# Altium schematic sheet Managment_MCU.SchDoc
size 420 x 297 mm; SheetNumber: 2; SheetTotal: 6; ModifiedBy: -; CheckedDate: -; Title2: Title 2; DivGrp: WUT ISE; Designer: G.Kasprowicz
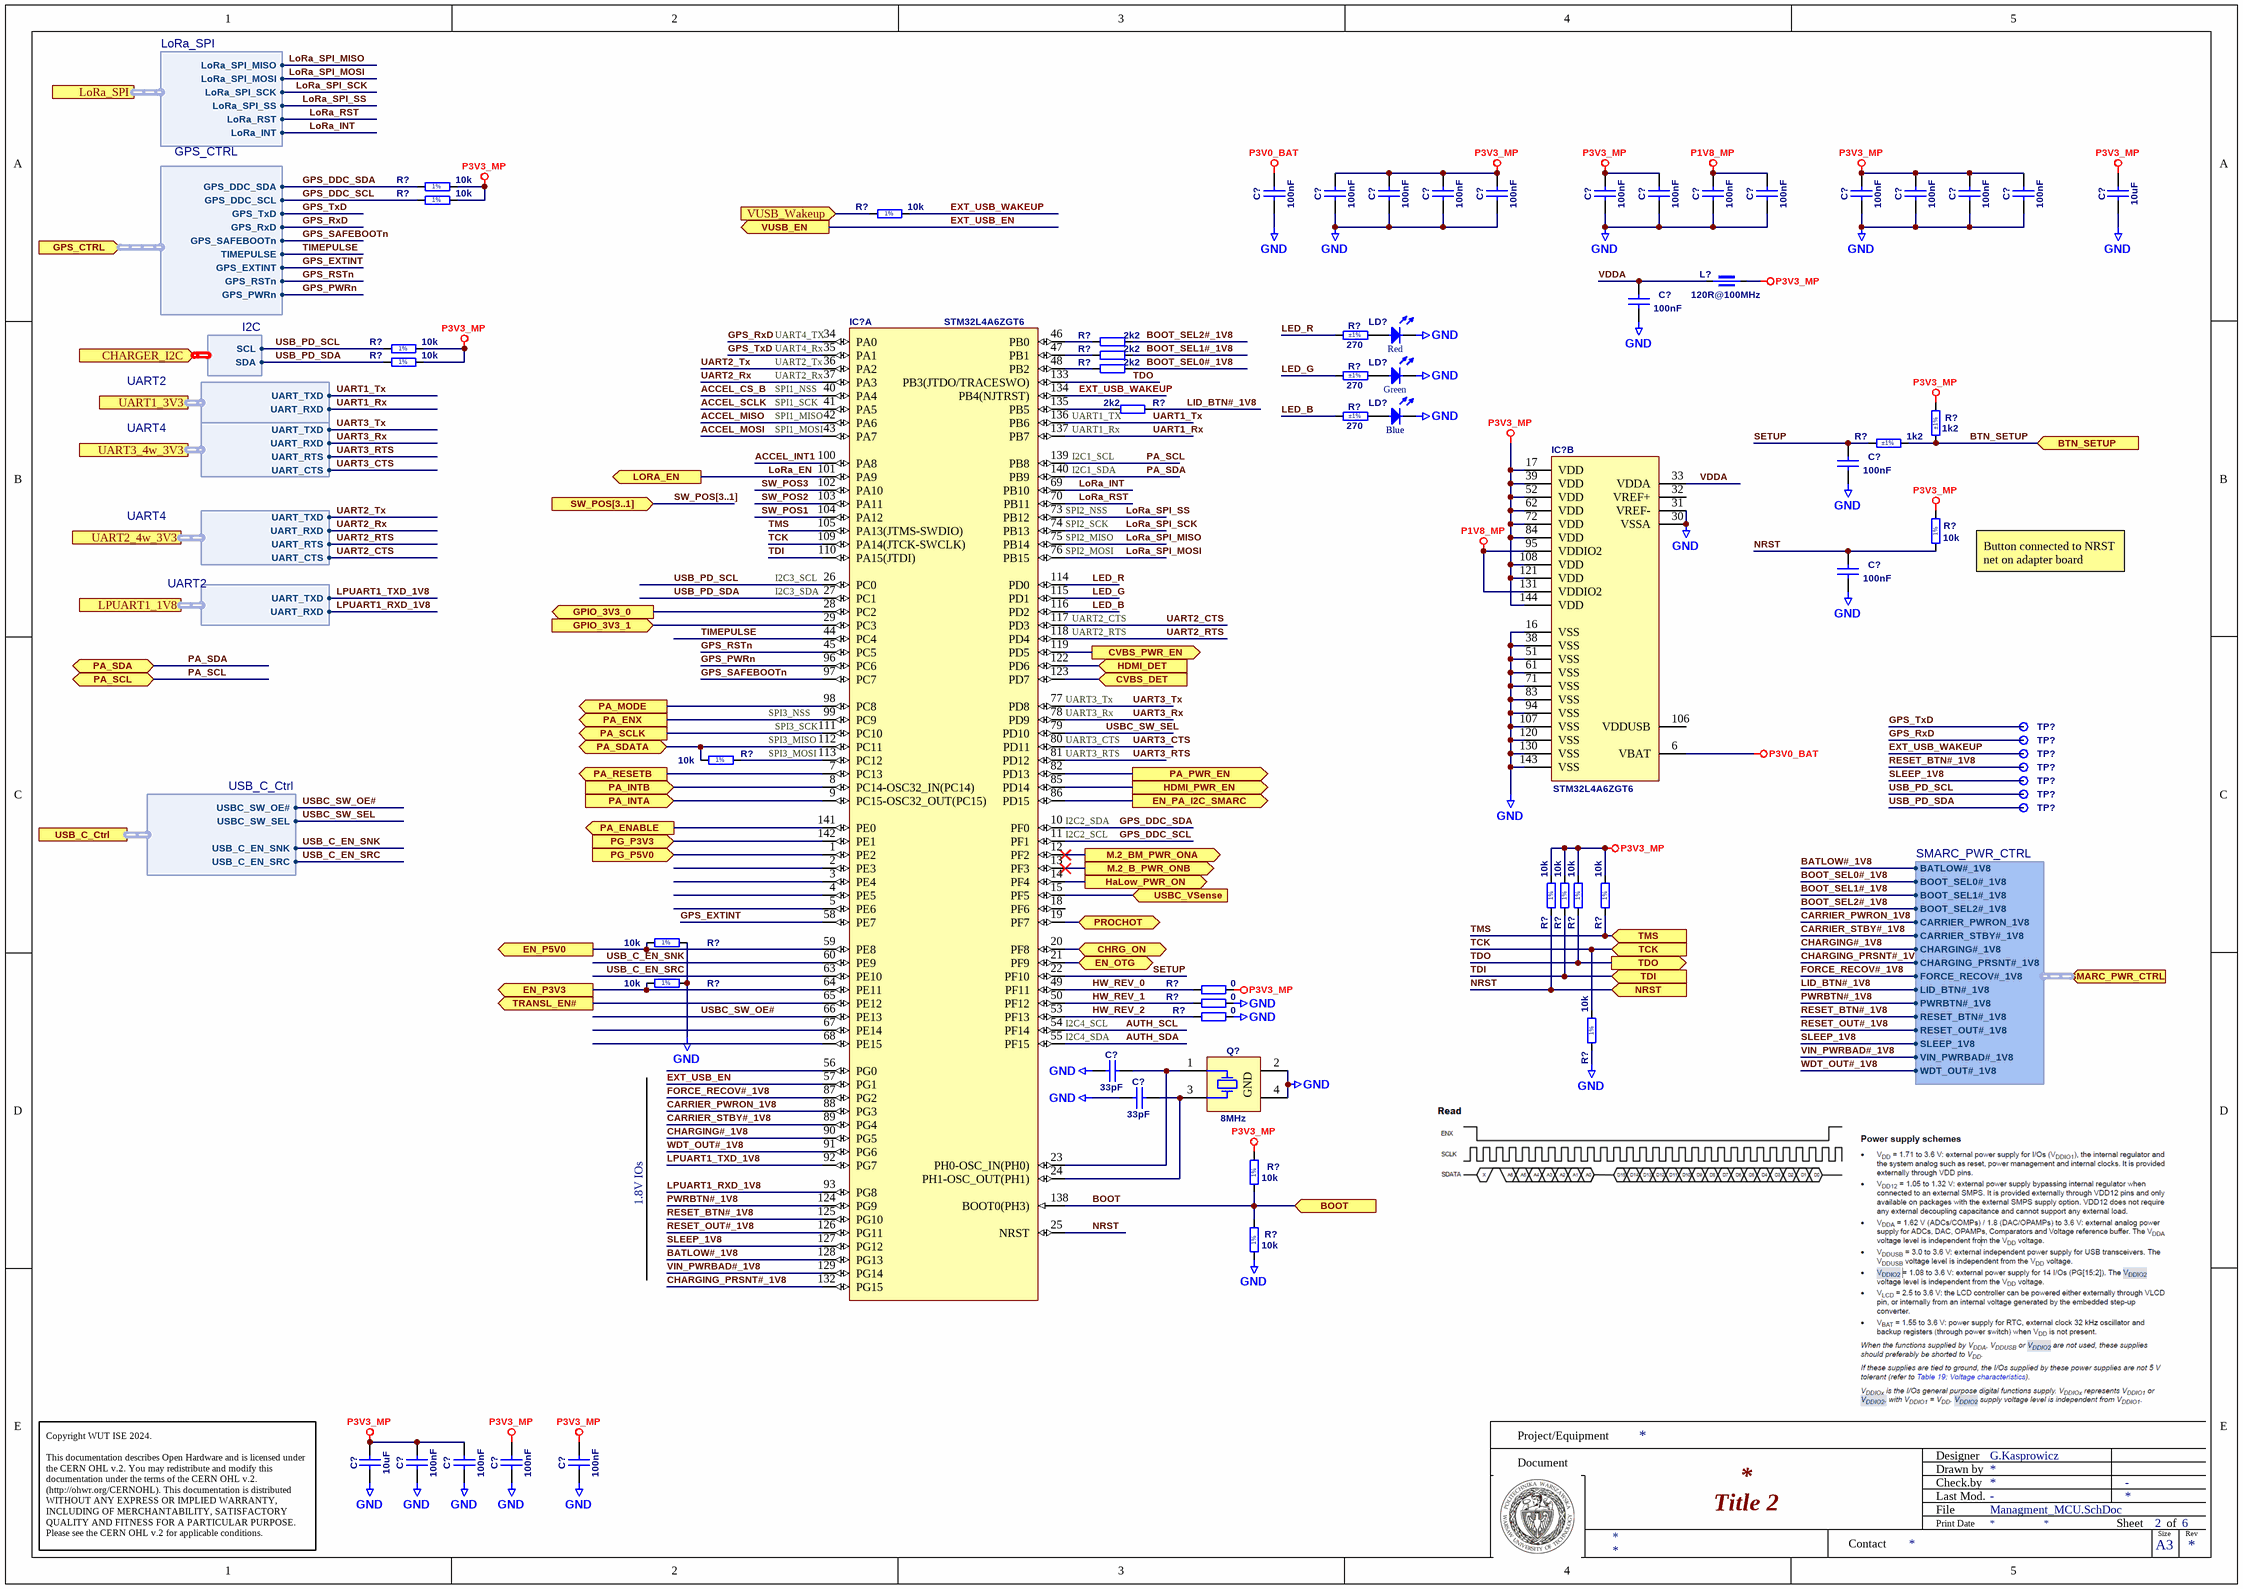
[diagram p0: Managment_MCU.SchDoc]

## Parts
(Parts that share a designator on the sheet are numbered #1, #2 ... from top to bottom, then left to right.)
C?#1  100nF  [CAPC1005X55N]
C?#2  100nF  [CAPC1005X55N]
C?#3  100nF  [CAPC1005X55N]
C?#4  100nF  [CAPC1005X55N]
C?#5  100nF  [CAPC1005X55N]
C?#6  100nF  [CAPC1005X55N]
C?#7  100nF  [CAPC1005X55N]
C?#8  100nF  [CAPC1005X55N]
C?#9  100nF  [CAPC1005X55N]
C?#10  100nF  [CAPC1005X55N]
C?#11  100nF  [CAPC1005X55N]
C?#12  100nF  [CAPC1005X55N]
C?#13  100nF  [CAPC1005X55N]
C?#14  10uF  [CAPC1608X80N]
C?#15  100nF  [CAPC1005X55N]
C?#16  100nF  [CAPC1005X55N]
C?#17  100nF  [CAPC1005X55N]
C?#18  33pF  [CAPC1005X55N]
C?#19  33pF  [CAPC1005X55N]
C?#20  10uF  [CAPC1608X80N]
C?#21  100nF  [CAPC1005X55N]
C?#22  100nF  [CAPC1005X55N]
C?#23  100nF  [CAPC1005X55N]
C?#24  100nF  [CAPC1005X55N]
IC?#1  STM32L4A6ZGT6  [QFP50P2200X2200X160-144N]  (part A of 2)
IC?#2  STM32L4A6ZGT6  [QFP50P2200X2200X160-144N]  (part B of 2)
L?  120R@100MHz  [INDC1608X65N]
LD?#1  Red  [LED_AVAGO_HSMC-C120]
LD?#2  Green  [LED_AVAGO_HSME-C120]
LD?#3  Blue  [LED_AVAGO_HSMR-C120]
Q?  8MHz  [XTAL_ECS_ECX-32]
R?#1  10k  [RESC1005X40N]
R?#2  10k  [RESC1005X40N]
R?#3  10k  [RESC1005X40N]
R?#4  270  Tolerance: ±1%  [RESC1005X40N]
R?#5  2k2  [RESC1005X40N]
R?#6  10k  [RESC1005X40N]
R?#7  2k2  [RESC1005X40N]
R?#8  10k  [RESC1005X40N]
R?#9  2k2  [RESC1005X40N]
R?#10  270  Tolerance: ±1%  [RESC1005X40N]
R?#11  2k2  [RESC1005X40N]
R?#12  270  Tolerance: ±1%  [RESC1005X40N]
R?#13  1k2  Tolerance: ±1%  [RESC1005X40N]
R?#14  1k2  Tolerance: ±1%  [RESC1005X40N]
R?#15  10k  [RESC1005X40N]
R?#16  10k  [RESC1005X40N]
R?#17  10k  [RESC1005X40N]
R?#18  10k  [RESC1005X40N]
R?#19  10k  [RESC1005X40N]
R?#20  10k  [RESC1005X40N]
R?#21  10k  [RESC1005X40N]
R?#22  10k  [RESC1005X40N]
R?#23  0  [RESC1005X40N]
R?#24  0  [RESC1005X40N]
R?#25  0  [RESC1005X40N]
R?#26  10k  [RESC1005X40N]
R?#27  10k  [RESC1005X40N]
R?#28  10k  [RESC1005X40N]
TP?#1  Test Point  [TPS127]  (value not drawn)  (no BOM)
TP?#2  Test Point  [TPS127]  (value not drawn)  (no BOM)
TP?#3  Test Point  [TPS127]  (value not drawn)  (no BOM)
TP?#4  Test Point  [TPS127]  (value not drawn)  (no BOM)
TP?#5  Test Point  [TPS127]  (value not drawn)  (no BOM)
TP?#6  Test Point  [TPS127]  (value not drawn)  (no BOM)
TP?#7  Test Point  [TPS127]  (value not drawn)  (no BOM)

## Ports
BOOT (in), BTN_SETUP (in), CHARGER_I2C (in, harness I2C), CHRG_ON (bidir), CVBS_DET (in), CVBS_PWR_EN (out), EN_OTG (bidir), EN_P3V3 (out), EN_P5V0 (out), EN_PA_I2C_SMARC (out), GPIO_3V3_0 (out), GPIO_3V3_1 (in), GPS_CTRL (in, harness GPS_CTRL), HaLow_PWR_ON (out), HDMI_DET (in), HDMI_PWR_EN (out), LORA_EN (out), LoRa_SPI (harness LoRa_SPI), LPUART1_1V8 (harness UART2), M.2_B_PWR_ONB (out), M.2_BM_PWR_ONA (out), NRST (in), PA_ENABLE (out), PA_ENX (out), PA_INTA (in), PA_INTB (in), PA_MODE (out), PA_PWR_EN (out), PA_RESETB (out), PA_SCL (bidir), PA_SCLK (out), PA_SDA (bidir), PA_SDATA (bidir), PG_P3V3 (in), PG_P5V0 (in), PROCHOT (bidir), SMARC_PWR_CTRL (in, harness SMARC_PWR_CTRL), SW_POS[3..1] (in), TCK (in), TDI (in), TDO (out), TMS (in), TRANSL_EN# (out), UART1_3V3 (harness UART2), UART2_4w_3V3 (harness UART4), UART3_4w_3V3 (harness UART4), USB_C_Ctrl (harness USB_C_Ctrl), USBC_VSense (in), VUSB_EN (out), VUSB_Wakeup (in)

## Harnesses
LoRa_SPI: LoRa_SPI_MISO, LoRa_SPI_MOSI, LoRa_SPI_SCK, LoRa_SPI_SS, LoRa_RST, LoRa_INT
GPS_CTRL: GPS_TxD, GPS_RxD, GPS_SAFEBOOTn, TIMEPULSE, GPS_EXTINT, GPS_RSTn, GPS_DDC_SDA, GPS_DDC_SCL, GPS_PWRn
I2C: SCL, SDA
SMARC_PWR_CTRL: BATLOW#_1V8, BOOT_SEL0#_1V8, BOOT_SEL1#_1V8, BOOT_SEL2#_1V8, CARRIER_PWRON_1V8, CARRIER_STBY#_1V8, CHARGING#_1V8, CHARGING_PRSNT#_1V8, FORCE_RECOV#_1V8, LID_BTN#_1V8, PWRBTN#_1V8, RESET_BTN#_1V8, RESET_OUT#_1V8, SLEEP_1V8, VIN_PWRBAD#_1V8, WDT_OUT#_1V8
UART4: UART_TXD, UART_RXD, UART_RTS, UART_CTS
UART2: UART_TXD, UART_RXD
USB_C_Ctrl: USBC_SW_OE#, USBC_SW_SEL, USB_C_EN_SNK, USB_C_EN_SRC

## Nets
GND: C?#1.1 C?#2.1 C?#3.1 C?#4.1 C?#5.1 C?#6.1 C?#7.1 C?#8.1 C?#9.1 C?#10.1 C?#11.1 C?#12.1 C?#13.1 C?#14.1 C?#15.1 C?#16.1 C?#17.1 C?#18.1 C?#19.1 C?#20.1 C?#21.1 C?#22.1 C?#23.1 C?#24.1 IC?#2.16(VSS) IC?#2.30(VSSA) IC?#2.31(VREF-) IC?#2.38(VSS) IC?#2.51(VSS) IC?#2.61(VSS) IC?#2.71(VSS) IC?#2.83(VSS) IC?#2.94(VSS) IC?#2.107(VSS) IC?#2.120(VSS) IC?#2.130(VSS) IC?#2.143(VSS) LD?#1.1(C) LD?#2.1(C) LD?#3.1(C) Q?.2(GND) Q?.4(GND) R?#21.2 R?#22.2 R?#24.1 R?#25.1 R?#26.1 R?#28.1
P1V8_MP: C?#8.2 C?#9.2 IC?#2.95(VDDIO2) IC?#2.131(VDDIO2)
P3V0_BAT: C?#1.2 IC?#2.6(VBAT)
P3V3_MP: C?#2.2 C?#3.2 C?#4.2 C?#5.2 C?#6.2 C?#7.2 C?#10.2 C?#11.2 C?#12.2 C?#13.2 C?#14.2 C?#20.2 C?#21.2 C?#22.2 C?#23.2 C?#24.2 IC?#2.17(VDD) IC?#2.39(VDD) IC?#2.52(VDD) IC?#2.62(VDD) IC?#2.72(VDD) IC?#2.84(VDD) IC?#2.108(VDD) IC?#2.121(VDD) IC?#2.144(VDD) L?.2 R?#1.2 R?#2.2 R?#6.2 R?#8.2 R?#14.2 R?#15.2 R?#17.2 R?#18.2 R?#19.2 R?#20.2 R?#23.2 R?#27.2
ACCEL_CS_B: IC?#1.40(PA4)
ACCEL_INT1: IC?#1.100(PA8)
ACCEL_MISO: IC?#1.42(PA6)
ACCEL_MOSI: IC?#1.43(PA7)
ACCEL_SCLK: IC?#1.41(PA5)
AUTH_SCL: IC?#1.54(PF14)
AUTH_SDA: IC?#1.55(PF15)
BATLOW#_1V8: IC?#1.128(PG13) ; port SMARC_PWR_CTRL.BATLOW#_1V8
BOOT: IC?#1.138(BOOT0(PH3)) R?#27.1 R?#28.2 ; port BOOT
BOOT_SEL0#_1V8: R?#9.2 ; port SMARC_PWR_CTRL.BOOT_SEL0#_1V8
BOOT_SEL1#_1V8: R?#7.2 ; port SMARC_PWR_CTRL.BOOT_SEL1#_1V8
BOOT_SEL2#_1V8: R?#5.2 ; port SMARC_PWR_CTRL.BOOT_SEL2#_1V8
BTN_SETUP: R?#13.2 R?#14.1 ; port BTN_SETUP
CARRIER_PWRON_1V8: IC?#1.88(PG3) ; port SMARC_PWR_CTRL.CARRIER_PWRON_1V8
CARRIER_STBY#_1V8: IC?#1.89(PG4) ; port SMARC_PWR_CTRL.CARRIER_STBY#_1V8
CHARGING#_1V8: IC?#1.90(PG5) ; port SMARC_PWR_CTRL.CHARGING#_1V8
CHARGING_PRSNT#_1V8: IC?#1.132(PG15) ; port SMARC_PWR_CTRL.CHARGING_PRSNT#_1V8
CHRG_ON: IC?#1.20(PF8) ; port CHRG_ON
CVBS_DET: IC?#1.123(PD7) ; port CVBS_DET
CVBS_PWR_EN: IC?#1.119(PD5) ; port CVBS_PWR_EN
EN_OTG: IC?#1.21(PF9) ; port EN_OTG
EN_P3V3: IC?#1.64(PE11) R?#22.1 ; port EN_P3V3
EN_P5V0: IC?#1.59(PE8) R?#21.1 ; port EN_P5V0
EN_PA_I2C_SMARC: IC?#1.86(PD15) ; port EN_PA_I2C_SMARC
EXT_USB_EN: IC?#1.57(PG1) ; port VUSB_EN
EXT_USB_WAKEUP: IC?#1.134(PB4(NJTRST)) R?#3.2 TP?#3.1
FORCE_RECOV#_1V8: IC?#1.87(PG2) ; port SMARC_PWR_CTRL.FORCE_RECOV#_1V8
GPIO_3V3_0: IC?#1.28(PC2) ; port GPIO_3V3_0
GPIO_3V3_1: IC?#1.29(PC3) ; port GPIO_3V3_1
GPS_DDC_SCL: IC?#1.11(PF1) R?#2.1 ; port GPS_CTRL.GPS_DDC_SCL
GPS_DDC_SDA: IC?#1.10(PF0) R?#1.1 ; port GPS_CTRL.GPS_DDC_SDA
GPS_EXTINT: IC?#1.58(PE7) ; port GPS_CTRL.GPS_EXTINT
GPS_PWRn: IC?#1.96(PC6) ; port GPS_CTRL.GPS_PWRn
GPS_RSTn: IC?#1.45(PC5) ; port GPS_CTRL.GPS_RSTn
GPS_RxD: IC?#1.34(PA0) TP?#2.1 ; port GPS_CTRL.GPS_RxD
GPS_SAFEBOOTn: IC?#1.97(PC7) ; port GPS_CTRL.GPS_SAFEBOOTn
GPS_TxD: IC?#1.35(PA1) TP?#1.1 ; port GPS_CTRL.GPS_TxD
HaLow_PWR_ON: IC?#1.14(PF4) ; port HaLow_PWR_ON
HDMI_DET: IC?#1.122(PD6) ; port HDMI_DET
HDMI_PWR_EN: IC?#1.85(PD14) ; port HDMI_PWR_EN
HW_REV_0: IC?#1.49(PF11) R?#23.1
HW_REV_1: IC?#1.50(PF12) R?#24.2
HW_REV_2: IC?#1.53(PF13) R?#25.2
LED_B: IC?#1.116(PD2) R?#12.2
LED_G: IC?#1.115(PD1) R?#10.2
LED_R: IC?#1.114(PD0) R?#4.2
LID_BTN#_1V8: R?#11.1 ; port SMARC_PWR_CTRL.LID_BTN#_1V8
LoRa_EN: IC?#1.101(PA9) ; port LORA_EN
LoRa_INT: IC?#1.69(PB10) ; port LoRa_SPI.LoRa_INT
LoRa_RST: IC?#1.70(PB11) ; port LoRa_SPI.LoRa_RST
LoRa_SPI_MISO: IC?#1.75(PB14) ; port LoRa_SPI.LoRa_SPI_MISO
LoRa_SPI_MOSI: IC?#1.76(PB15) ; port LoRa_SPI.LoRa_SPI_MOSI
LoRa_SPI_SCK: IC?#1.74(PB13) ; port LoRa_SPI.LoRa_SPI_SCK
LoRa_SPI_SS: IC?#1.73(PB12) ; port LoRa_SPI.LoRa_SPI_SS
LPUART1_RXD_1V8: IC?#1.93(PG8) ; port LPUART1_1V8.UART_RXD
LPUART1_TXD_1V8: IC?#1.92(PG7) ; port LPUART1_1V8.UART_TXD
M.2_B_PWR_ONB: IC?#1.13(PF3) ; port M.2_B_PWR_ONB
M.2_BM_PWR_ONA: IC?#1.12(PF2) ; port M.2_BM_PWR_ONA
NRST: C?#17.2 IC?#1.25(NRST) R?#15.1 R?#17.1 ; port NRST
PA_ENABLE: IC?#1.141(PE0) ; port PA_ENABLE
PA_ENX: IC?#1.99(PC9) ; port PA_ENX
PA_INTA: IC?#1.9(PC15-OSC32_OUT(PC15)) ; port PA_INTA
PA_INTB: IC?#1.8(PC14-OSC32_IN(PC14)) ; port PA_INTB
PA_MODE: IC?#1.98(PC8) ; port PA_MODE
PA_PWR_EN: IC?#1.82(PD13) ; port PA_PWR_EN
PA_RESETB: IC?#1.7(PC13) ; port PA_RESETB
PA_SCL: IC?#1.139(PB8) ; port PA_SCL
PA_SCLK: IC?#1.111(PC10) ; port PA_SCLK
PA_SDA: IC?#1.140(PB9) ; port PA_SDA
PA_SDATA: IC?#1.112(PC11) R?#16.1 ; port PA_SDATA
PG_P3V3: IC?#1.142(PE1) ; port PG_P3V3
PG_P5V0: IC?#1.1(PE2) ; port PG_P5V0
PROCHOT: IC?#1.19(PF7) ; port PROCHOT
PWRBTN#_1V8: IC?#1.124(PG9) ; port SMARC_PWR_CTRL.PWRBTN#_1V8
RESET_BTN#_1V8: IC?#1.125(PG10) TP?#4.1 ; port SMARC_PWR_CTRL.RESET_BTN#_1V8
RESET_OUT#_1V8: IC?#1.126(PG11) ; port SMARC_PWR_CTRL.RESET_OUT#_1V8
SETUP: C?#16.2 IC?#1.22(PF10) R?#13.1
SLEEP_1V8: IC?#1.127(PG12) TP?#5.1 ; port SMARC_PWR_CTRL.SLEEP_1V8
SW_POS1: IC?#1.104(PA12)
SW_POS2: IC?#1.103(PA11)
SW_POS3: IC?#1.102(PA10)
TCK: IC?#1.109(PA14(JTCK-SWCLK)) R?#26.2 ; port TCK
TDI: IC?#1.110(PA15(JTDI)) R?#18.1 ; port TDI
TDO: IC?#1.133(PB3(JTDO/TRACESWO)) R?#19.1 ; port TDO
TIMEPULSE: IC?#1.44(PC4) ; port GPS_CTRL.TIMEPULSE
TMS: IC?#1.105(PA13(JTMS-SWDIO)) R?#20.1 ; port TMS
TRANSL_EN#: IC?#1.65(PE12) ; port TRANSL_EN#
UART1_Rx: IC?#1.137(PB7) ; port UART1_3V3.UART_RXD
UART1_Tx: IC?#1.136(PB6) ; port UART1_3V3.UART_TXD
UART2_CTS: IC?#1.117(PD3) ; port UART2_4w_3V3.UART_CTS
UART2_RTS: IC?#1.118(PD4) ; port UART2_4w_3V3.UART_RTS
UART2_Rx: IC?#1.37(PA3) ; port UART2_4w_3V3.UART_RXD
UART2_Tx: IC?#1.36(PA2) ; port UART2_4w_3V3.UART_TXD
UART3_CTS: IC?#1.80(PD11) ; port UART3_4w_3V3.UART_CTS
UART3_RTS: IC?#1.81(PD12) ; port UART3_4w_3V3.UART_RTS
UART3_Rx: IC?#1.78(PD9) ; port UART3_4w_3V3.UART_RXD
UART3_Tx: IC?#1.77(PD8) ; port UART3_4w_3V3.UART_TXD
USB_C_EN_SNK: IC?#1.60(PE9) ; port USB_C_Ctrl.USB_C_EN_SNK
USB_C_EN_SRC: IC?#1.63(PE10) ; port USB_C_Ctrl.USB_C_EN_SRC
USB_PD_SCL: IC?#1.26(PC0) R?#6.1 TP?#6.1 ; port CHARGER_I2C.SCL
USB_PD_SDA: IC?#1.27(PC1) R?#8.1 TP?#7.1 ; port CHARGER_I2C.SDA
USBC_SW_OE#: IC?#1.66(PE13) ; port USB_C_Ctrl.USBC_SW_OE#
USBC_SW_SEL: IC?#1.79(PD10) ; port USB_C_Ctrl.USBC_SW_SEL
USBC_VSense: IC?#1.15(PF5) ; port USBC_VSense
VDDA: C?#15.2 IC?#2.33(VDDA) L?.1
VIN_PWRBAD#_1V8: IC?#1.129(PG14) ; port SMARC_PWR_CTRL.VIN_PWRBAD#_1V8
VUSB_Wakeup: R?#3.1 ; port VUSB_Wakeup
WDT_OUT#_1V8: IC?#1.91(PG6) ; port SMARC_PWR_CTRL.WDT_OUT#_1V8
NetC?#18_2: C?#18.2 IC?#1.23(PH0-OSC_IN(PH0)) Q?.1(X)
NetC?#19_2: C?#19.2 IC?#1.24(PH1-OSC_OUT(PH1)) Q?.3(X)
NetIC?#1_46: IC?#1.46(PB0) R?#5.1
NetIC?#1_47: IC?#1.47(PB1) R?#7.1
NetIC?#1_48: IC?#1.48(PB2) R?#9.1
NetIC?#1_113: IC?#1.113(PC12) R?#16.2
NetIC?#1_135: IC?#1.135(PB5) R?#11.2
NetLD?#1_2: LD?#1.2(A) R?#4.1
NetLD?#2_2: LD?#2.2(A) R?#10.1
NetLD?#3_2: LD?#3.2(A) R?#12.1

Not connected (* = marked no-connect by the designer): IC?#1 2(PE3) 3(PE4) 4(PE5) 5(PE6) 18(PF6) 56(PG0) 67(PE14) 68(PE15); IC?#2 32(VREF+) 106(VDDUSB)

## Buses and harness runs
bus SW_POS[3..1] = port SW_POS[3..1]

## Notes on the sheet
- (near IC?#1) UART4_TX
- (near IC?#1) UART4_Rx
- (near IC?#1) SPI1_NSS
- (near IC?#1) UART2_Tx
- (near IC?#1) UART2_Rx
- (near IC?#1) SPI1_SCK
- (near IC?#1) SPI1_MISO
- (near IC?#1) SPI1_MOSI
- (near R?#11) UART1_TX
- (near R?#11) UART1_Rx
- I2C1_SCL
- (near IC?#1) SPI2_NSS
- (near IC?#1) SPI2_SCK
- (near IC?#1) I2C1_SDA
- (near IC?#1) I2C3_SDA
- (near IC?#1) I2C3_SCL
- (near IC?#1) SPI2_MISO
- (near IC?#1) SPI2_MOSI
- (near R?#15) Button connected to NRST net on adapter board
- (near IC?#1) UART2_RTS
- (near IC?#1) UART2_CTS
- SPI3_NSS
- SPI3_SCK
- (near IC?#1) UART3_Tx
- (near IC?#1) UART3_Rx
- SPI3_MISO
- SPI3_MOSI
- (near IC?#1) UART3_RTS
- (near IC?#1) UART3_CTS
- (near IC?#1) I2C2_SDA
- (near IC?#1) I2C2_SCL
- I2C4_SCL
- I2C4_SDA
- 1.8V IOs
- Project/Equipment
- Document
- Designer
- Drawn by
- Check.by
- Copyright WUT ISE 2024.
  This documentation describes Open Hardware and is licensed under the CERN OHL v.2. You may redistribute and modify this documentation under the terms of the CERN OHL v.2. (http://ohwr.org/CERNOHL). This documentation is distributed WITHOUT ANY EXPRESS OR IMPLIED WARRANTY, INCLUDING OF MERCHANTABILITY, SATISFACTORY QUALITY AND FITNESS FOR A PARTICULAR PURPOSE. Please see the CERN OHL v.2 for applicable conditions.
- Contact
- File
- Last Mod.
- Print Date
- Sheet
- Size
- A3
- of
- Rev
- (in symbol R0402_10K_1%_0.0625W_100PPM) 1%

## Library data of the parts
C?#1-C?#13 C?#15-C?#17 C?#21-C?#24 = CC0402_100NF_50V_10%_X7R: Non-polarised capacitor; Part Description: SMD Multilayer Chip Ceramic Capacitor; Manufacturer: GENERIC; Manufacturer 1: MURATA; Manufacturer 1 Part Number: GRM155R71H104KE14D; Voltage: 50V; TC: X7R; Tolerance: ±10%; Part Number: CC0402_100NF_50V_10%_X7R; Component Kind: Standard; Component Type: Standard; Pin Count: 2; Value: 100nF; Status: None; Manufacturer Part Number: CC0402_100NF_50V_10%_X7R; Case: 0402; Mounted: Yes; Socket: No; SMD: Yes; Sense: No; Manufacturer1 ComponentHeight: 0.55mm; HelpURL: \\cern.ch\dfs\Applications\Altium\Datasheets\CC0402_MURATA_GRM155R71H104KE14D.pdf; Author: CERN DEM MR; CreateDate: 30.06.2017; LatestRevisionDate: 30.06.2017
C?#14 C?#20 = CC0603_10UF_16V_20%_X5R: Non-polarised capacitor; Part Description: SMD Multilayer Chip Ceramic Capacitor; Manufacturer: GENERIC; Manufacturer 1: MURATA; Manufacturer 1 Part Number: GRM188R61C106MA73D; Voltage: 16V; TC: X5R; Tolerance: ±20%; Part Number: CC0603_10UF_16V_20%_X5R; Component Kind: Standard; Component Type: Standard; Pin Count: 2; Value: 10uF; Status: None; Manufacturer Part Number: CC0603_10UF_16V_20%_X5R; Case: 0603; Mounted: Yes; Socket: No; SMD: Yes; Sense: No; Manufacturer1 ComponentHeight: 0.8mm; HelpURL: \\cern.ch\dfs\Applications\Altium\Datasheets\CC0603_X5R_MURATA_GRM.pdf; Author: CERN DEM MR; CreateDate: 02.03.2016; LatestRevisionDate: 02.03.2016
C?#18 C?#19 = CC0402_33PF_50V_5%_C0G: Non-polarised capacitor; Part Description: SMD Multilayer Chip Ceramic Capacitor; Manufacturer: GENERIC; Manufacturer 1: KEMET; Manufacturer 1 Part Number: C0402C330J5GACTU; Voltage: 50V; TC: C0G/NP0; Tolerance: ±5%; Part Number: CC0402_33PF_50V_5%_C0G; Component Kind: Standard; Component Type: Standard; Pin Count: 2; Value: 33pF; Status: Preferred; Manufacturer Part Number: CC0402_33PF_50V_5%_C0G; Case: 0402; Mounted: Yes; Socket: No; SMD: Yes; Sense: No; Manufacturer1 ComponentHeight: 0.55mm; HelpURL: \\cern.ch\dfs\Applications\Altium\Datasheets\CC0805_C0G_KEMET_(Commercial Grade).pdf; Author: CERN DEM JLC; CreateDate: 03.12.2007; LatestRevisionDate: 22.04.2015
IC?#1 IC?#2 = UPC_STM32L4A6ZGT6: Ultra-low-power ARM Cortex-M4 32b MCU+FPU, 100DMIP,  1 MB Flash, 320 kB RAM, 115 I/Os, 144-pin LQFP, Industrial Grade; Manufacturer 1: ST MICROELECTRONICS; PressFit: No; Bonding: No; Part Number: STM32L4A6ZGT6; Component Kind: Standard; Component Type: Standard; Device: STM32L4A6ZGT6; PackageDescription: QFP, 0.50mm Pitch, Square; 144 Pin, 20.00mm L X 20.00mm W X 1.60mm H Body, IPC Medium Density; Part Description: Ultra-low-power ARM Cortex-M4 32b MCU+FPU, 100DMIP,  1 MB Flash, 320 kB RAM, 115 I/Os, 144-pin LQFP, Industrial Grade; Manufacturer 1 Part Number: STM32L4A6ZGT6; Pin Count: 144; Case: QFP144; Mounted: Yes; Socket: No; SMD: Yes; Sense: No; ComponentHeight: 1.6mm; HelpURL: \\cern.ch\dfs\Applications\Altium\Datasheets\STM32F407ZGT6.pdf; Author: GK; CreateDate: 14.07.2016; LatestRevisionDate: 14.07.2016
L? = IND0603_MURATA_BLM18SG121TN1D: Part Description: SMD EMIFIL Suppression Chip Ferrite Bead; Manufacturer 1: MURATA; Power: 3A; Resistance: 0.025R; Tolerance: ±25%; LatestRevisionDate: 25.10.2018; Value: 120R@100MHz; Part Number: IND0603_MURATA_BLM18SG121TN1D; Component Kind: Standard; Component Type: Standard; Pin Count: 2; Status: None; Manufacturer 1 Part Number: BLM18SG121TN1D; Case: 0603; Mounted: Yes; Socket: No; SMD: Yes; Sense: No; ComponentHeight: 0.65mm; HelpURL: \\cern.ch\dfs\Applications\Altium\Datasheets\IND0603_MURATA_BLM18S.pdf; Author: CERN DEM JLC; CreateDate: 23.07.2014
LD?#1 = LED_AVAGO_HSMC-C120: LED Red 1C 2A; Part Description: High Performance Right Angle Chip Red LED; Manufacturer 1: AVAGO TECHNOLOGIES; PressFit: No; Bonding: No; Part Number: LED_AVAGO_HSMC-C120; Component Kind: Standard; Component Type: Standard; Color: Red; PackageDescription: Red Chip LED, 2-Leads, Body 1.7x1.1mm, Side Emitting Package; Manufacturer 1 Part Number: HSMC-C120; Pin Count: 2; Mounted: Yes; Socket: No; SMD: Yes; Sense: No; ComponentHeight: 0.7mm; HelpURL: \\cern.ch\dfs\Applications\Altium\Datasheets\LED_AVAGO_HSMC-C120.pdf; ComponentLink1URL: \\cern.ch\dfs\Applications\Altium\Datasheets\LED_AVAGO_HSMC-C120_DESIGN-GUIDE.pdf; ComponentLink1Description: Design Guide; Author: CERN DEM JMW; CreateDate: 22.07.2009; LatestRevisionDate: 20.06.2012
LD?#2 = LED_AVAGO_HSME-C120: LED Green 1C 2A; Part Description: High Performance Right Angle Chip Green LED; Manufacturer 1: AVAGO TECHNOLOGIES; PressFit: No; Bonding: No; Part Number: LED_AVAGO_HSME-C120; Component Kind: Standard; Component Type: Standard; Color: Green; PackageDescription: Green Chip LED, 2-Leads, Body 1.7x1.1mm, Side Emitting Package; Manufacturer 1 Part Number: HSME-C120; Pin Count: 2; Mounted: Yes; Socket: No; SMD: Yes; Sense: No; ComponentHeight: 0.7mm; HelpURL: \\cern.ch\dfs\Applications\Altium\Datasheets\LED_AVAGO_HSME-C120.pdf; ComponentLink1URL: \\cern.ch\dfs\Applications\Altium\Datasheets\LED_AVAGO_HSME-C110_DESIGN-GUIDE.pdf; ComponentLink1Description: Design Guide; Author: CERN DEM JMW; CreateDate: 22.07.2009; LatestRevisionDate: 20.06.2012
LD?#3 = LED_AVAGO_HSMR-C120: LED Blue 1C 2A; Part Description: High Performance Right Angle Chip InGaN Blue LED; Manufacturer 1: AVAGO TECHNOLOGIES; PressFit: No; Bonding: No; Part Number: LED_AVAGO_HSMR-C120; Component Kind: Standard; Component Type: Standard; Color: Blue; PackageDescription: Blue Chip LED, 2-Leads, Body 1.7x1.1mm, Side Emitting Package; Manufacturer 1 Part Number: HSMR-C120; Pin Count: 2; Mounted: Yes; Socket: No; SMD: Yes; Sense: No; ComponentHeight: 0.7mm; HelpURL: \\cern.ch\dfs\Applications\Altium\Datasheets\LED_AVAGO_HSMR-C120.pdf; Author: CERN DEM JLC; CreateDate: 07.07.2014; LatestRevisionDate: 07.07.2014
Q? = XTAL_8MHZ_ECS_ECS-80-12-33-JGN-TR: Crystal 4 pins 1=XTAL Control 2=GND3=XTAL 4=GND; Part Description: Tolerance: ±20ppm, Stability: ±30ppm, -40°C to +85°C, 12pF, SMD 3.2 x W 2.5mm H 0.8mm ECX-32 Series; Manufacturer 1: ECS; PressFit: No; Bonding: No; Part Number: XTAL_8MHZ_ECS_ECS-80-12-33-JGN-TR; Component Kind: Standard; Component Type: Standard; PackageDescription: ECX-32 Series SMD Resonator, Body L 3.2 x W 2.5mm H 0.8mm; Value: 8MHz; Manufacturer 1 Part Number: ECS-80-12-33-JGN-TR; Pin Count: 4; Mounted: Yes; Socket: No; SMD: No; Sense: No; ComponentHeight: 0.8mm; Author: KB; CreateDate: 18.10.2021; LatestRevisionDate: 18.10.2021
R?#1-R?#3 R?#6 R?#8 R?#15-R?#22 R?#26 = R0402_10K_1%_0.0625W_100PPM: Resistor - 1%; Part Description: General Purpose Thick Film Chip Resistor; Manufacturer: GENERIC; Manufacturer 1: YAGEO PHYCOMP; Manufacturer 1 Part Number: 232270671003L; TC: ±100ppm/°C; Table: Resistors SMD; Part Number: R0402_10K_1%_0.0625W_100PPM; Component Kind: Standard; Component Type: Standard; Pin Count: 2; Value: 10k; Status: Not recommended; Power: 0.0625W; Tolerance: ±1%; Manufacturer Part Number: R0402_10K_1%_0.0625W_100PPM; Case: 0402; Mounted: Yes; Socket: No; SMD: Yes; Manufacturer1 ComponentHeight: 0.4mm; HelpURL: \\cern.ch\dfs\Applications\Altium\Datasheets\R0402_Phycomp_RC0402.pdf; Author: CERN DEM JLC; CreateDate: 2007-12-03; LatestRevisionDate: 2012-10-17
R?#4 R?#10 R?#12 = R0402_270R_1%_0.0625W_100PPM: Resistor - 1%; Part Description: General Purpose Thick Film Chip Resistor; Manufacturer: GENERIC; Manufacturer 1: YAGEO PHYCOMP; Manufacturer 1 Part Number: 232270672701L; TC: ±100ppm/°C; PressFit: No; Part Number: R0402_270R_1%_0.0625W_100PPM; Component Kind: Standard; Component Type: Standard; Pin Count: 2; Value: 270; Status: Not Recommended; Power: 0.0625W; Manufacturer Part Number: R0402_270R_1%_0.0625W_100PPM; Case: 0402; Mounted: Yes; Sense: No; Socket: No; SMD: Yes; Manufacturer1 ComponentHeight: 0.4mm; HelpURL: \\cern.ch\dfs\Applications\Altium\Datasheets\R0402_Phycomp_RC0402.pdf; Author: CERN DEM JLC; CreateDate: 03.12.2007; LatestRevisionDate: 17.10.2012
R?#5 R?#7 R?#9 R?#11 = R0402_2K2_1%_0.0625W_100PPM: Resistor - 1%; Part Description: General Purpose Thick Film Chip Resistor; Manufacturer: GENERIC; Manufacturer 1: YAGEO PHYCOMP; Manufacturer 1 Part Number: 232270672202L; TC: ±100ppm/°C; PressFit: No; Part Number: R0402_2K2_1%_0.0625W_100PPM; Component Kind: Standard; Component Type: Standard; Pin Count: 2; Value: 2k2; Status: Not Recommended; Power: 0.0625W; Tolerance: ±1%; Manufacturer Part Number: R0402_2K2_1%_0.0625W_100PPM; Case: 0402; Mounted: Yes; Sense: No; Socket: No; SMD: Yes; Manufacturer1 ComponentHeight: 0.4mm; HelpURL: \\cern.ch\dfs\Applications\Altium\Datasheets\R0402_Phycomp_RC0402.pdf; Author: CERN DEM JLC; CreateDate: 03.12.2007; LatestRevisionDate: 17.10.2012
R?#13 R?#14 = R0402_1K2_1%_0.0625W_100PPM: Resistor - 1%; Part Description: General Purpose Thick Film Chip Resistor; Manufacturer: GENERIC; Manufacturer 1: YAGEO PHYCOMP; Manufacturer 1 Part Number: 232270671202L; TC: ±100ppm/°C; PressFit: No; Part Number: R0402_1K2_1%_0.0625W_100PPM; Component Kind: Standard; Component Type: Standard; Pin Count: 2; Value: 1k2; Status: Not Recommended; Power: 0.0625W; Manufacturer Part Number: R0402_1K2_1%_0.0625W_100PPM; Case: 0402; Mounted: Yes; Sense: No; Socket: No; SMD: Yes; Manufacturer1 ComponentHeight: 0.4mm; HelpURL: \\cern.ch\dfs\Applications\Altium\Datasheets\R0402_Phycomp_RC0402.pdf; Author: CERN DEM JLC; CreateDate: 03.12.2007; LatestRevisionDate: 17.10.2012
R?#23-R?#25 = R0402_0R_JUMPER: Resistor; Part Description: 1A (0.05R Max DC Resistance) Zero Ohm Jumper; Manufacturer: GENERIC; Manufacturer 1: YAGEO PHYCOMP; Manufacturer 1 Part Number: 232270591001L; PressFit: No; Part Number: R0402_0R_JUMPER; Component Kind: Standard; Component Type: Standard; Pin Count: 2; Value: 0; Status: Not Recommended; Manufacturer Part Number: R0402_0R_JUMPER; Case: 0402; Mounted: Yes; Sense: No; Socket: No; SMD: Yes; Manufacturer1 ComponentHeight: 0.4mm; HelpURL: \\cern.ch\dfs\Applications\Altium\Datasheets\R0402_Phycomp_RC0402.pdf; Author: CERN DEM JLC; CreateDate: 03.12.2007; LatestRevisionDate: 17.10.2012
R?#27 R?#28 = R0402_10K_1%_0.0625W_100PPM: Resistor - 1%; Part Description: General Purpose Thick Film Chip Resistor; Manufacturer: GENERIC; Manufacturer 1: YAGEO PHYCOMP; Manufacturer 1 Part Number: 232270671003L; TC: ±100ppm/°C; PressFit: No; Value: 10k; Part Number: R0402_10K_1%_0.0625W_100PPM; Component Kind: Standard; Component Type: Standard; Pin Count: 2; Status: Not Recommended; Power: 0.0625W; Tolerance: ±1%; Manufacturer Part Number: R0402_10K_1%_0.0625W_100PPM; Case: 0402; Mounted: Yes; Sense: No; Socket: No; SMD: Yes; Manufacturer1 ComponentHeight: 0.4mm; HelpURL: \\cern.ch\dfs\Applications\Altium\Datasheets\R0402_Phycomp_RC0402.pdf; Author: CERN DEM JLC; CreateDate: 03/12/2007; LatestRevisionDate: 17/10/2012
TP?#1-TP?#7 = SMD_PAD_1.27X1.27MM: Part Description: 1.27mm x 1.27mm PCB Copper Area (SMD Test Point); Mounted: No; Part Number: SMD_PAD_1.27X1.27MM; Component Type: Standard (No BOM); Pin Count: 1; Family: Test Point; Socket: No; SMD: Yes; Sense: No; Status: None; ComponentHeight: 0mm; HelpURL: Undefined; Author: CERN DEM JLC; CreateDate: 12.01.2008; LatestRevisionDate: 12.01.2008; PackageDescription: 1.27mm x 1.27mm PCB Copper Area (SMD Test Point)